# Altium project TelemetrySystemAltiumProject.PrjPcb
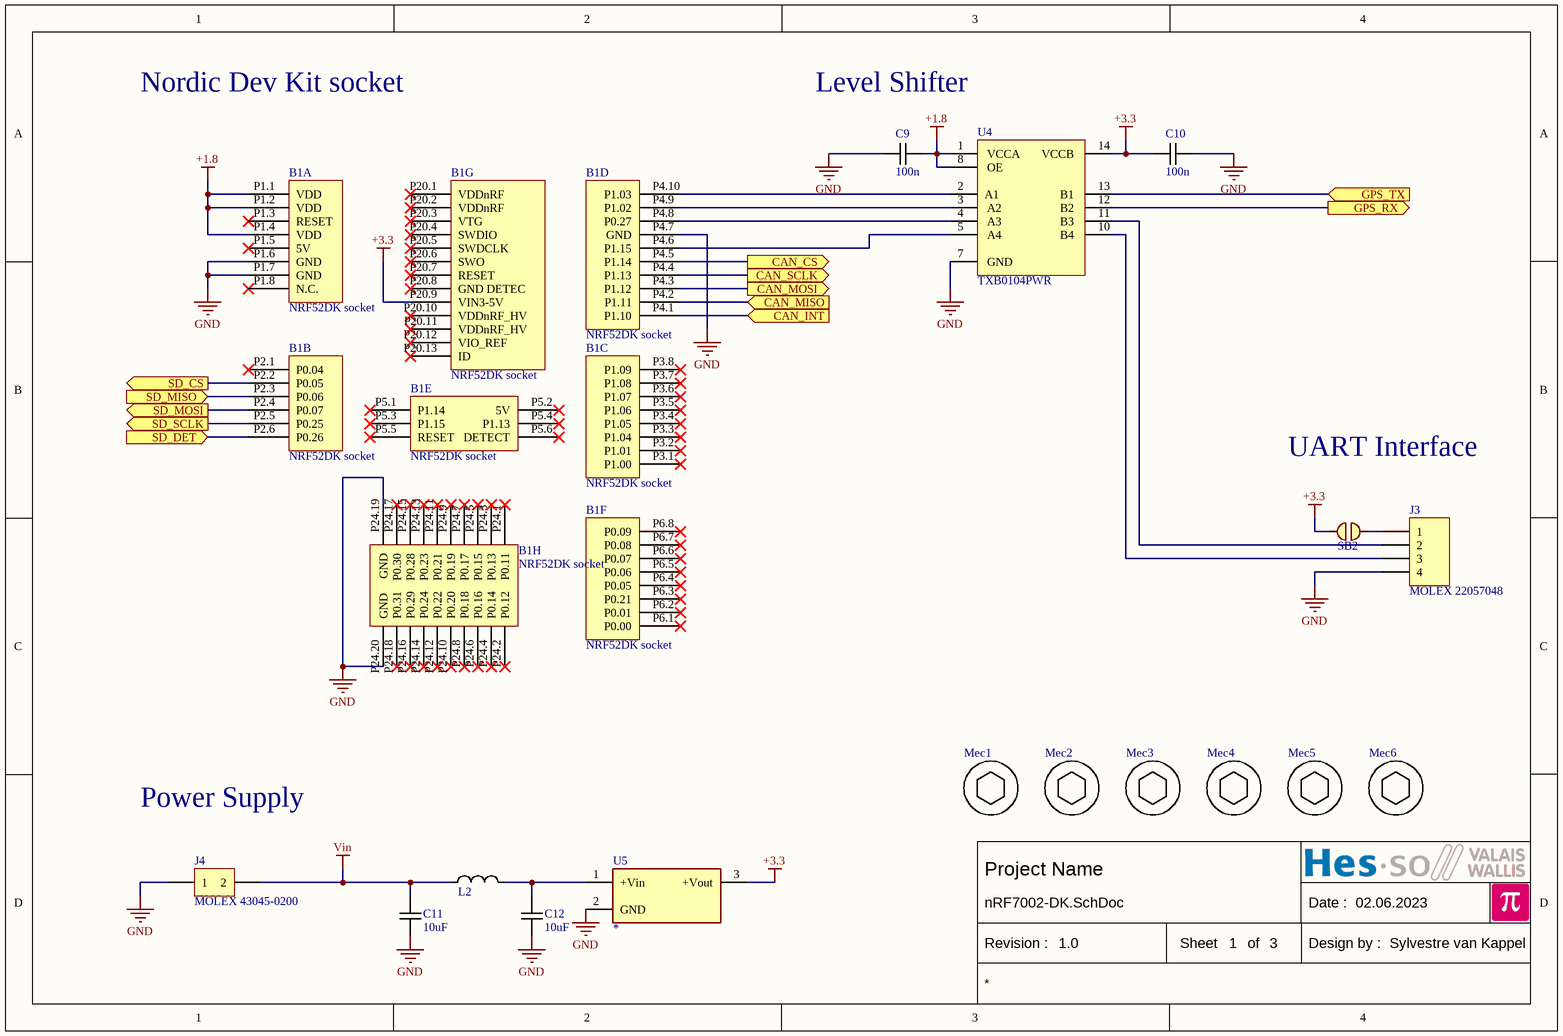
[diagram p0: nRF7002-DK.SchDoc]
PcbDate: 09.06.2023; PcbDesigner: Sylvestre van Kappel; PcbRevision: 1.0; SchematicDate: 02.06.2023; SchematicDesigner: Sylvestre van Kappel; SchematicRevision: 1.0
3 sheets, 63 parts. Net scope: flat (ports and power ports of the same name join across sheets).
Board file: TelemetryBoard.PcbDoc
Sheets:
  nRF7002-DK.SchDoc
  CanController.SchDoc
  GPS-SD.SchDoc

## Sheet nRF7002-DK.SchDoc
size A4; Date: Date; CompanyName: HESSO; Engineer: Name; Address1: Route du Rawyl 47; Address2: 1950 Sion; Address3: Switzerland; DocumentNumber: 3; SheetNumber: 1; SheetTotal: 3; ProjectName: Project Name

### Parts
B1  NRF52DK socket  [nRF5340DK SOCKET]  (parts A,B,C,D,E,F,G,H of 8)
C9  100n  [CAPACITOR 1608 REFLOW]
C10  100n  [CAPACITOR 1608 REFLOW]
C11  10uF  [CAPACITOR 3216 REFLOW]
C12  10uF  [CAPACITOR 3216 REFLOW]
J3  MOLEX 22057048  [MOLEX 22057048]
J4  MOLEX 43045-0200  [MOLEX 43045-0200]
L2  *  [TCK141]  (value not drawn)
Mec1  (no value)  [Screw Hex Socket M3X5 Unconnected]
Mec2  (no value)  [Screw Hex Socket M3X5 Unconnected]
Mec3  (no value)  [Screw Hex Socket M3X5 Unconnected]
Mec4  (no value)  [Screw Hex Socket M3X5 Unconnected]
Mec5  (no value)  [Screw Hex Socket M3X5 Unconnected]
Mec6  (no value)  [Screw Hex Socket M3X5 Unconnected]
SB2  *  [Solder Bridge 1mm Unconnected]  (value not drawn)  (net tie, no BOM)
U4  TXB0104PWR  [TSSOP14 P0.65 C4.4x5.0 H1.1]
U5  *  [TRACO TSR 1]

### Ports
CAN_CS (out), CAN_INT (in), CAN_MISO (in), CAN_MOSI (out), CAN_SCLK (out), GPS_RX (out), GPS_TX (in), SD_CS (out), SD_DET (in), SD_MISO (in), SD_MOSI (out), SD_SCLK (out)

### Nets
+1.8: B1.P1.1(VDD) B1.P1.2(VDD) B1.P1.4(VDD) C9.1 U4.1(VCCA) U4.8(OE)
+3.3: B1.P20.9(VIN3-5V) C10.2 SB2.2 U4.14(VCCB) U5.3(+Vout)
GND: B1.P1.6(GND) B1.P1.7(GND) B1.P4.7(GND) B1.P24.19(GND) B1.P24.20(GND) C9.2 C10.1 C11.2 C12.2 J3.4 J4.1 U4.7(GND) U5.2(GND)
Vin: C11.1 J4.2 L2.1
NetB1_P2.2: B1.P2.2(P0.05) ; port SD_CS
NetB1_P2.3: B1.P2.3(P0.06) ; port SD_MISO
NetB1_P2.4: B1.P2.4(P0.07) ; port SD_MOSI
NetB1_P2.5: B1.P2.5(P0.25) ; port SD_SCLK
NetB1_P2.6: B1.P2.6(P0.26) ; port SD_DET
NetB1_P4.1: B1.P4.1(P1.10) ; port CAN_INT
NetB1_P4.2: B1.P4.2(P1.11) ; port CAN_MISO
NetB1_P4.3: B1.P4.3(P1.12) ; port CAN_MOSI
NetB1_P4.4: B1.P4.4(P1.13) ; port CAN_SCLK
NetB1_P4.5: B1.P4.5(P1.14) ; port CAN_CS
NetB1_P4.6: B1.P4.6(P1.15) U4.5(A4)
NetB1_P4.8: B1.P4.8(P0.27) U4.4(A3)
NetB1_P4.9: B1.P4.9(P1.02) U4.3(A2)
NetB1_P4.10: B1.P4.10(P1.03) U4.2(A1)
NetC12_1: C12.1 L2.2 U5.1(+Vin)
NetJ3_1: J3.1 SB2.1
NetJ3_2: J3.2 U4.11(B3)
NetJ3_3: J3.3 U4.10(B4)
NetJP2_1: U4.12(B2) ; port GPS_RX
NetJP3_1: U4.13(B1) ; port GPS_TX

Not connected (* = marked no-connect by the designer): B1 P1.3(RESET)* P1.5(5V)* P1.8(N.C.)* P2.1(P0.04)* P3.1(P1.00)* P3.2(P1.01)* P3.3(P1.04)* P3.4(P1.05)* P3.5(P1.06)* P3.6(P1.07)* P3.7(P1.08)* P3.8(P1.09)* P5.1(P1.14)* P5.2(5V)* P5.3(P1.15)* P5.4(P1.13)* P5.5(RESET)* P5.6(DETECT)* P6.1(P0.00)* P6.2(P0.01)* P6.3(P0.21)* P6.4(P0.05)* P6.5(P0.06)* P6.6(P0.07)* P6.7(P0.08)* P6.8(P0.09)* P20.1(VDDnRF)* P20.2(VDDnRF)* P20.3(VTG)* P20.4(SWDIO)* P20.5(SWDCLK)* P20.6(SWO)* P20.7(RESET)* P20.8(GND_DETEC)* P20.10(VDDnRF_HV)* P20.11(VDDnRF_HV)* P20.12(VIO_REF)* P20.13(ID)* P24.1(P0.11)* P24.2(P0.12)* P24.3(P0.13)* P24.4(P0.14)* P24.5(P0.15)* P24.6(P0.16)* P24.7(P0.17)* P24.8(P0.18)* P24.9(P0.19)* P24.10(P0.20)* P24.11(P0.21)* P24.12(P0.22)* P24.13(P0.23)* P24.14(P0.24)* P24.15(P0.28)* P24.16(P0.29)* P24.17(P0.30)* P24.18(P0.31)*

### Notes on the sheet
- Nordic Dev Kit socket
- Level Shifter
- UART Interface
- Power Supply
- Date :
- Revision :
- Sheet
- of
- Design by :

### Library data of the parts
B1 = nRF5340DK Socket: nRF53 development kit; Value: NRF52DK socket
C9-C12 = Capacitor: Value: *
J3 = MOLEX 22057048: KK 254 Wire-to-Board Header, Right-Angle, 4 Circuits
J4 = MOLEX 43045-0200: Micro-Fit 3.0 Right-Angle Header, 3.00mm, Dual Row, 2 Circuits
L2 = Inductor: Value: *
Mec1-Mec6 = Screw Hex Socket Unconnected: Screw Hex Socket Unconnected BN610
SB2 = Solderbridge Unconnected: Value: *
U4 = TXB0104PWR: 4-Bit Bidirectional Voltage-Level Translator With utomatic Direction Sensing and ±15-kV ESD Protection; Value: TXB0104PWR
U5 = TRACO TSR 1: DC/DC Converter; Value: *

## Sheet CanController.SchDoc
size A4; CompanyName: HESSO; Address1: Route du Rawyl 47; Address2: 1950 Sion; Address3: Switzerland; DocumentNumber: 4; SheetNumber: 2; SheetTotal: 3; PageSetup: Record=PageOptions|CenterHorizontal=True|CenterVertical=True|PrintScale=1.00|XCorrection=1.00|YCorrection=1.00|PrintKind=1|BorderSize=5000000|LeftOffset=0|BottomOffset=0|Orientation=2|PaperLength=1000|PaperWidth=1000|Scale=100|PaperSource=15|PrintQuality=1200|MediaType=1|DitherType=10|PrintScaleMode=1|PaperKind=A4|PaperIndex=9; ProjectName: Project Name
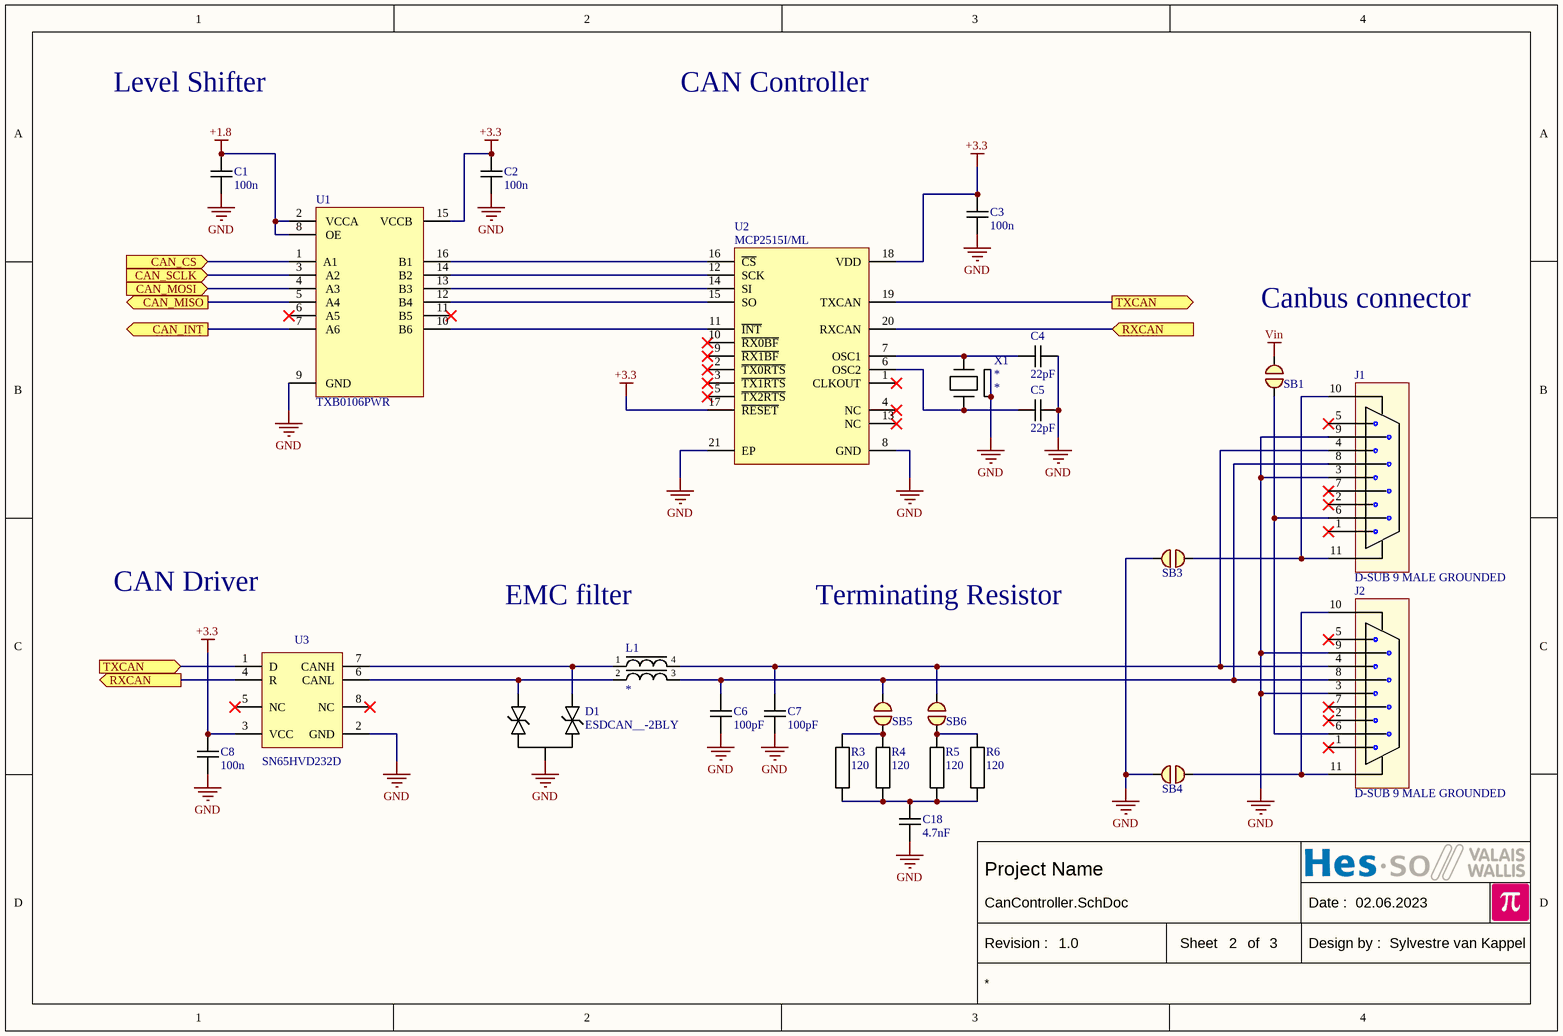
[diagram p1: CanController.SchDoc]

### Parts
C1  100n  [CAPACITOR 1608 REFLOW]
C2  100n  [CAPACITOR 1608 REFLOW]
C3  100n  [CAPACITOR 1608 REFLOW]
C4  22pF  [CAPACITOR 1608 REFLOW]
C5  22pF  [CAPACITOR 1608 REFLOW]
C6  100pF  [CAPACITOR 1608 REFLOW]
C7  100pF  [CAPACITOR 1608 REFLOW]
C8  100n  [CAPACITOR 1608 REFLOW]
C18  4.7nF  [CAPACITOR 1608 REFLOW]
D1  ESDCAN__-2BLY  [SOT23 P0.95 C1.6x3.0 H1.3]
J1  D-SUB 9 MALE GROUNDED  [D-SUB 9 MALE ANGLE]
J2  D-SUB 9 MALE GROUNDED  [D-SUB 9 MALE ANGLE]
L1  *  [L CM 2X B82793C EPCOS]
R3  120  [RESISTOR 1608 REFLOW]
R4  120  [RESISTOR 1608 REFLOW]
R5  120  [RESISTOR 1608 REFLOW]
R6  120  [RESISTOR 1608 REFLOW]
SB1  *  [Solder Bridge 1mm Unconnected]  (value not drawn)  (net tie, no BOM)
SB3  *  [Solder Bridge 1mm Unconnected]  (value not drawn)  (net tie, no BOM)
SB4  *  [Solder Bridge 1mm Unconnected]  (value not drawn)  (net tie, no BOM)
SB5  *  [Solder Bridge 1mm Unconnected]  (value not drawn)  (net tie, no BOM)
SB6  *  [Solder Bridge 1mm Unconnected]  (value not drawn)  (net tie, no BOM)
U1  TXB0106PWR  [TSSOP16 P0.65 C5.0x4.5 H1.1]
U2  MCP2515I/ML  [QFN20 P0.5 T2.05x2.05 C4.0x4.0 H0.85]
U3  SN65HVD232D  [SO8 P1.27 C4.0X5.0 H1.75]
X1  *  [CRYSTAL C3.2x2.5 Kyocera CX3225SB]

### Ports
CAN_CS (in), CAN_INT (out), CAN_MISO (out), CAN_MOSI (in), CAN_SCLK (in), RXCAN (in), RXCAN (out), TXCAN (in), TXCAN (out)

### Nets
+1.8: C1.2 U1.2(VCCA) U1.8(OE)
+3.3: C2.2 C3.2 C8.2 U1.15(VCCB) U2.17(~{RESET}) U2.18(VDD) U3.3(VCC)
GND: C1.1 C2.1 C3.1 C4.1 C5.1 C6.1 C7.1 C8.1 C18.1 D1.3(COM) J1.3 J1.9 J2.3 J2.9 SB3.1 SB4.1 U1.9(GND) U2.8(GND) U2.21(EP) U3.2(GND) X1.2 X1.4
Vin: SB1.1
NetB1_P4.1: U1.7(A6) ; port CAN_INT
NetB1_P4.2: U1.5(A4) ; port CAN_MISO
NetB1_P4.3: U1.4(A3) ; port CAN_MOSI
NetB1_P4.4: U1.3(A2) ; port CAN_SCLK
NetB1_P4.5: U1.1(A1) ; port CAN_CS
NetC4_2: C4.2 U2.7(OSC1) X1.3
NetC5_2: C5.2 U2.6(OSC2) X1.1
NetC6_2: C6.2 J1.8 J2.8 L1.3 SB5.2
NetC7_2: C7.2 J1.4 J2.4 L1.4 SB6.2
NetC18_2: C18.2 R3.1 R4.1 R5.1 R6.1
NetD1_1: D1.1(A1) L1.1 U3.7(CANH)
NetD1_2: D1.2(C2) L1.2 U3.6(CANL)
NetJ1_6: J1.6 J2.6 SB1.2
NetJ1_10: J1.10 J1.11 SB3.2
NetJ2_10: J2.10 J2.11 SB4.2
NetR3_2: R3.2 R4.2 SB5.1
NetR5_2: R5.2 R6.2 SB6.1
NetU1_10: U1.10(B6) U2.11(~{INT})
NetU1_12: U1.12(B4) U2.15(SO)
NetU1_13: U1.13(B3) U2.14(SI)
NetU1_14: U1.14(B2) U2.12(SCK)
NetU1_16: U1.16(B1) U2.16(~{CS})
NetU2_19: U2.19(TXCAN) U3.1(D) ; port TXCAN
NetU2_20: U2.20(RXCAN) U3.4(R) ; port RXCAN

Not connected (* = marked no-connect by the designer): J1 1* 2* 5* 7*; J2 1* 2* 5* 7*; U1 6(A5)* 11(B5)*; U2 1(CLKOUT)* 2(~{TX0RTS})* 3(~{TX1RTS})* 4(NC)* 5(~{TX2RTS})* 9(~{RX1BF})* 10(~{RX0BF})* 13(NC)*; U3 5(NC)* 8(NC)*

### Notes on the sheet
- Level Shifter
- CAN Controller
- Canbus connector
- CAN Driver
- EMC filter
- Terminating Resistor
- Date :
- Revision :
- Sheet
- of
- Design by :

### Library data of the parts
C1-C8 C18 = Capacitor: Value: *
D1 = Diode ESDCAN__-2BLY: Automotive dual-line TVS diode; Value: ESDCAN__-2BLY
J1 J2 = D-SUB 9 MALE GROUNDED: D-Subminiature 9 way Plug Right Angle; value: *
L1 = L CM 2X B82793C0 EPCOS: Inductor Common Mode Filter; Value: *
R3-R6 = Resistor: Value: *
SB1 SB3-SB6 = Solderbridge Unconnected: Value: *
U1 = TXB0106PWR: 6-Bit Bidirectional Level-Shifting and Voltage Translator / With Auto-Direction Sensing and ±15-kV ESD Protection; Value: TXB0106PWR
U2 = MCP2515I/ML: Stand-Alone CAN Controller with SPI Interface; Value: MCP2515I/ML
U3 = SN65HVD232D: CAN Bus Transceiver 3V3; Value: SN65HVD232D
X1 = Crystal C3.2x2.5 Kyocera CX3225SB: Value: *

## Sheet GPS-SD.SchDoc
size A4; Date: Date; CompanyName: HESSO; Engineer: Name; Address1: Route du Rawyl 47; Address2: 1950 Sion; Address3: Switzerland; SheetNumber: 3; SheetTotal: 2; ProjectName: Project Name
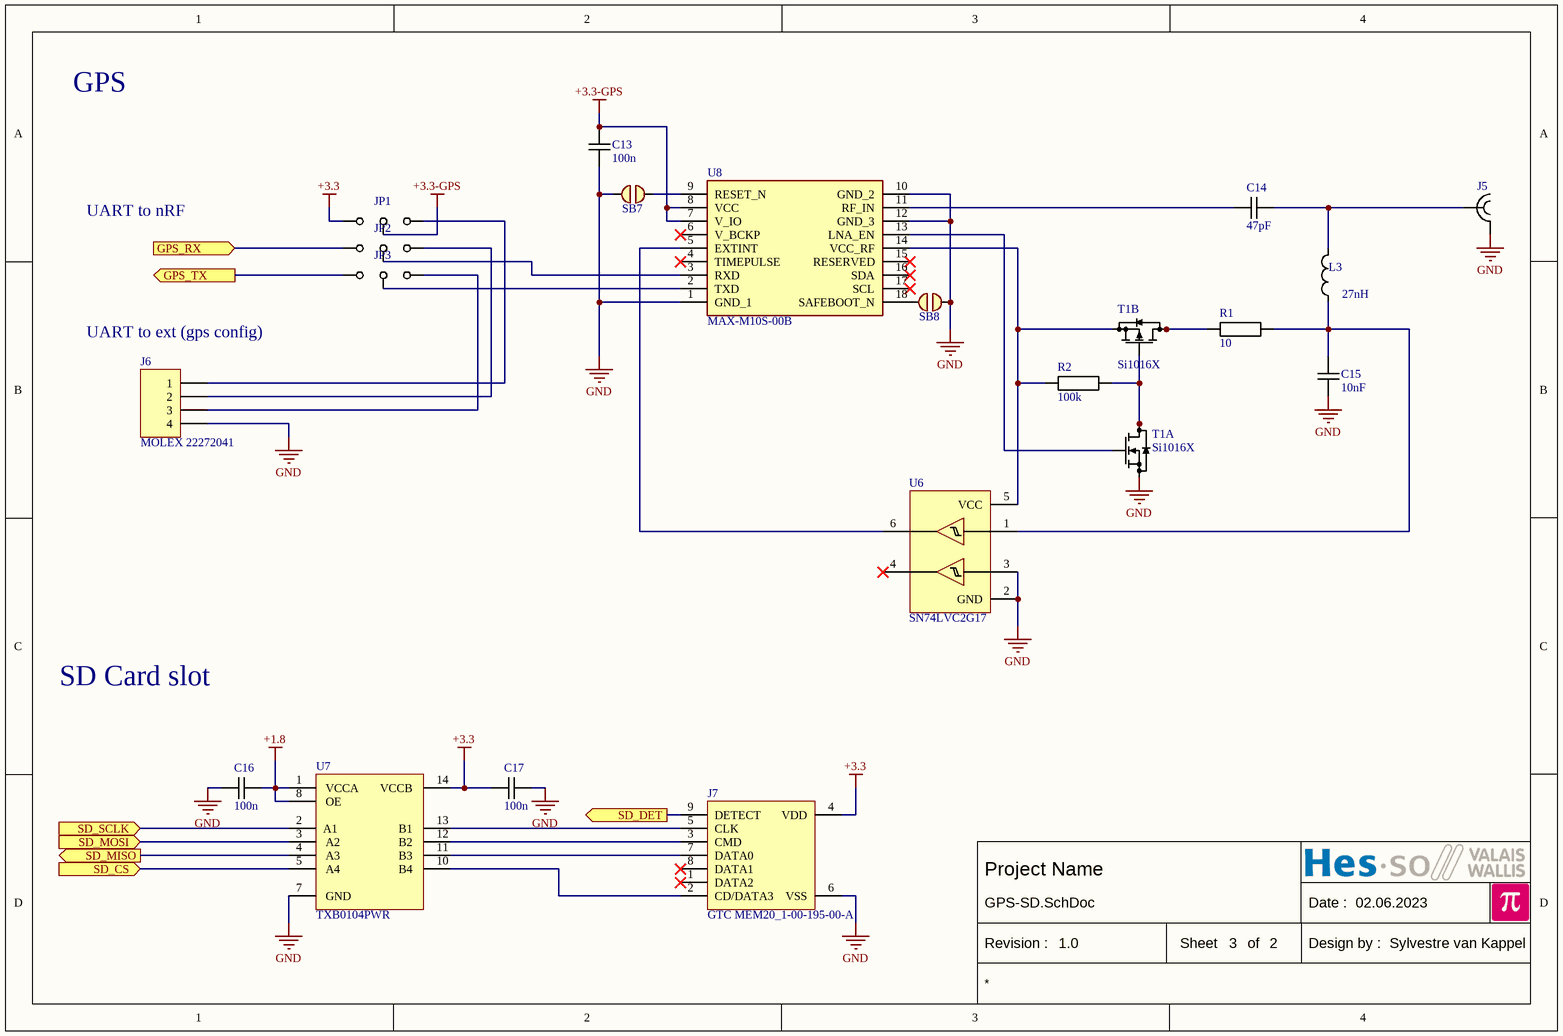
[diagram p2: GPS-SD.SchDoc]

### Parts
C13  100n  [CAPACITOR 1608 REFLOW]
C14  47pF  [CAPACITOR 1608 REFLOW]
C15  10nF  [CAPACITOR 1608 REFLOW]
C16  100n  [CAPACITOR 1608 REFLOW]
C17  100n  [CAPACITOR 1608 REFLOW]
J5  732511150  [SMA EDGE Molex 732511150]  (value not drawn)
J6  MOLEX 22272041  [MOLEX 22272041]
J7  GTC MEM20_1-00-195-00-A  [SD MICRO GCT MEM2051-00-195-00-A]
JP1  {Value}  [JUMPER3 SMD 1608]  (value not drawn)
JP2  {Value}  [JUMPER3 SMD 1608]  (value not drawn)
JP3  {Value}  [JUMPER3 SMD 1608]  (value not drawn)
L3  27nH  [INDUCTOR 1608 REFLOW]
R1  10  [RESISTOR 1608 REFLOW]
R2  100k  [RESISTOR 1608 REFLOW]
SB7  *  [Solder Bridge 1mm Unconnected]  (value not drawn)  (net tie, no BOM)
SB8  *  [Solder Bridge 1mm Unconnected]  (value not drawn)  (net tie, no BOM)
T1  Si1016X  [SOT563F P0.5 C1.6x1.2 H0.6]  (parts A,B of 2)
U6  SN74LVC2G17  [SOT23-6 P0.95 C1.5x3.0 H1.3]
U7  TXB0104PWR  [TSSOP14 P0.65 C4.4x5.0 H1.1]
U8  MAX-M10S-00B  [MAXM10S00B]

### Ports
GPS_RX (in), GPS_TX (out), SD_CS (in), SD_DET (out), SD_MISO (out), SD_MOSI (in), SD_SCLK (in)

### Nets
+1.8: C16.2 U7.1(VCCA) U7.8(OE)
+3.3: C17.2 J7.4(VDD) JP1.1 U7.14(VCCB)
+3.3-GPS: C13.1 JP1.2 U8.7(V_IO) U8.8(VCC)
GND: C13.2 C15.1 C16.1 C17.1 J5.2 J6.4 J7.6(VSS) SB7.1 SB8.2 T1.1(S1) U6.2(GND) U6.3(2A) U7.7(GND) U8.1(GND_1) U8.10(GND_2) U8.12(GND_3)
NetB1_P2.2: U7.5(A4) ; port SD_CS
NetB1_P2.3: U7.4(A3) ; port SD_MISO
NetB1_P2.4: U7.3(A2) ; port SD_MOSI
NetB1_P2.5: U7.2(A1) ; port SD_SCLK
NetB1_P2.6: J7.9(DETECT) ; port SD_DET
NetC14_1: C14.1 J5.1 L3.2
NetC14_2: C14.2 U8.11(RF_IN)
NetC15_2: C15.2 L3.1 R1.2 U6.1(1A)
NetJ6_1: J6.1 JP1.3
NetJ6_2: J6.2 JP2.3
NetJ6_3: J6.3 JP3.3
NetJ7_2: J7.2(CD/DATA3) U7.10(B4)
NetJ7_3: J7.3(CMD) U7.12(B2)
NetJ7_5: J7.5(CLK) U7.13(B1)
NetJ7_7: J7.7(DATA0) U7.11(B3)
NetJP2_1: JP2.1 ; port GPS_RX
NetJP2_2: JP2.2 U8.3(RXD)
NetJP3_1: JP3.1 ; port GPS_TX
NetJP3_2: JP3.2 U8.2(TXD)
NetR1_1: R1.1 T1.3(D2) T1.5(D2)
NetR2_1: R2.1 T1.4(S2) U6.5(VCC) U8.14(VCC_RF)
NetR2_2: R2.2 T1.5(G2) T1.6(D1) T1.7(D1)
NetSB7_2: SB7.2 U8.9(RESET_N)
NetSB8_1: SB8.1 U8.18(SAFEBOOT_N)
NetT1_2: T1.2(G1) U8.13(LNA_EN)
NetU6_6: U6.6(1Y) U8.5(EXTINT)

Not connected (* = marked no-connect by the designer): J7 1(DATA2)* 8(DATA1)*; U6 4(2Y)*; U8 4(TIMEPULSE)* 6(V_BCKP)* 15(RESERVED)* 16(SDA)* 17(SCL)*

### Notes on the sheet
- GPS
- UART to nRF
- (near J6) UART to ext (gps config)
- SD Card slot
- Date :
- Revision :
- Sheet
- of
- Design by :

### Library data of the parts
C13-C17 = Capacitor: Value: *
J5 = SMA EDGE Molex 732511150: Value: 732511150
J6 = MOLEX 22272041: KK 254 Wire-to-Board Header, Vertical, 4 Circuits
J7 = SD-MICRO GTC MEM20_1-00-195-00-A: SD Card Micro; MF: Global Connector Technology; MP: MEM2051-00-195-00-A; Purchase-URL: https://pricing.snapeda.com/search/part/MEM2051-00-195-00-A/?ref=eda; Price: None; SnapEDA_Link: https://www.snapeda.com/parts/MEM2051-00-195-00-A/Global%20Connector%20Technology/view-part/779220/?ref=snap; Check_prices: https://www.snapeda.com/parts/MEM2051-00-195-00-A/Global%20Connector%20Technology/view-part/779220/?ref=eda; Package: None; Value: GTC MEM20_1-00-195-00-A; Availability: Warning
JP1-JP3 = JUMPER 3 POS: Value: {Value}
L3 = Inductor: Value: *
R1 R2 = Resistor: Value: *
SB7 SB8 = Solderbridge Unconnected: Value: *
T1 = Si1016X: Complementary N- and P-Channel 20 V (D-S) MOSFET; Value: Si1016X
U6 = SN74LVC2G17: Dual Schmitt-Trigger Buffer; Value: SN74LVC2G17
U7 = TXB0104PWR: as U4 on sheet nRF7002-DK; Value: TXB0104PWR
U8 = MAX-M10S-00B: Standard precision GNSS module; Value: MAX-M10S-00B

## Nets that join several sheets
+1.8: nRF7002-DK (6 pins), CanController (C1.2 U1.2 U1.8), GPS-SD (C16.2 U7.1 U7.8)
+3.3: nRF7002-DK (5 pins), CanController (7 pins), GPS-SD (C17.2 J7.4 JP1.1 U7.14)
GND: nRF7002-DK (13 pins), CanController (22 pins), GPS-SD (16 pins)
Vin: nRF7002-DK (C11.1 J4.2 L2.1), CanController (SB1.1)
NetB1_P2.2: nRF7002-DK (B1.P2.2), GPS-SD (U7.5)
NetB1_P2.3: nRF7002-DK (B1.P2.3), GPS-SD (U7.4)
NetB1_P2.4: nRF7002-DK (B1.P2.4), GPS-SD (U7.3)
NetB1_P2.5: nRF7002-DK (B1.P2.5), GPS-SD (U7.2)
NetB1_P2.6: nRF7002-DK (B1.P2.6), GPS-SD (J7.9)
NetB1_P4.1: nRF7002-DK (B1.P4.1), CanController (U1.7)
NetB1_P4.2: nRF7002-DK (B1.P4.2), CanController (U1.5)
NetB1_P4.3: nRF7002-DK (B1.P4.3), CanController (U1.4)
NetB1_P4.4: nRF7002-DK (B1.P4.4), CanController (U1.3)
NetB1_P4.5: nRF7002-DK (B1.P4.5), CanController (U1.1)
NetJP2_1: nRF7002-DK (U4.12), GPS-SD (JP2.1)
NetJP3_1: nRF7002-DK (U4.13), GPS-SD (JP3.1)